# Altium schematic sheet Buck converter.SchDoc
size A; SheetNumber: 1; SheetTotal: 1
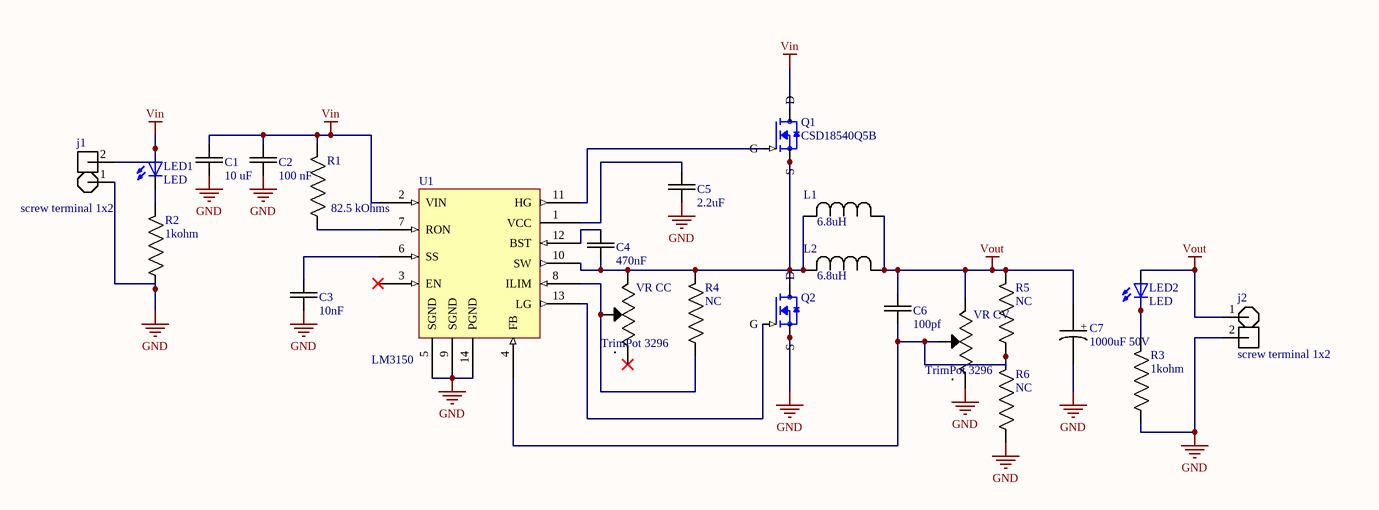
[diagram p0: Buck converter.SchDoc]

## Parts
C1  10 uF  [SMD Cap 805]
C2  100 nF  [SMD Cap 805]
C3  10nF  [SMD Cap 805]
C4  470nF  [SMD Cap 805]
C5  2.2uF  [SMD Cap 805]
C6  100pf  [SMD Cap 805]
C7  1000uF 50V  [CAP ELECTROLYTE 1000UF 50V]
j1  screw terminal 1x2  [screw terminal 1x2]
j2  screw terminal 1x2  [screw terminal 1x2]
L1  6.8uH  [Inductor DR127]
L2  6.8uH  [Inductor DR127]
LED1  LED  [LED3MM]
LED2  LED  [LED3MM]
Q1  CSD18540Q5B  [VSON-CLIP-8 - V2]
Q2  CSD18540Q5B  [VSON-CLIP-8 - V2]  (value not drawn)
R1  82.5 kOhms  [SMD Resistor 805]
R2  1kohm  [SMD Resistor 805]
R3  1kohm  [SMD Resistor 805]
R4  NC  [SMD Resistor 805]
R5  NC  [SMD Resistor 805]
R6  NC  [SMD Resistor 805]
U1  LM3150  [HTSSOP (14)]
VR_CC  TrimPot 3296  [TrimPOT 3296W]
VR_CV  TrimPot 3296  [TrimPOT 3296W]

## Nets
GND: C1.1 C2.1 C3.1 C5.1 C7.N(-) j1.1 j2.2 Q2.1(S) Q2.2(S) Q2.3(S) R2.1 R3.1 R6.1 U1.5(SGND) U1.9(SGND) U1.14(PGND) VR_CV.1(CCW)
Vin: C1.2 C2.2 j1.2 LED1.A Q1.5(D) R1.2 U1.2(VIN)
Vout: C6.2 C7.P(+) j2.1 L1.1 L2.1 LED2.A R5.2 VR_CV.3(CW)
NetC3_2: C3.2 U1.6(SS)
NetC4_1: C4.1 L1.2 L2.2 Q1.1(S) Q1.2(S) Q1.3(S) Q2.5(D) R4.2 U1.10(SW) VR_CC.3(CW)
NetC4_2: C4.2 U1.12(BST)
NetC5_2: C5.2 U1.1(VCC)
NetC6_1: C6.1 R5.1 R6.2 U1.4(FB) VR_CV.2(WIPER)
NetLED1_C: LED1.C R2.2
NetLED2_C: LED2.C R3.2
NetQ1_4: Q1.4(G) U1.11(HG)
NetQ2_4: Q2.4(G) U1.13(LG)
NetR1_1: R1.1 U1.7(RON)
NetR4_1: R4.1 U1.8(ILIM) VR_CC.2(WIPER)

Not connected (* = marked no-connect by the designer): U1 3(EN)*; VR_CC 1(CCW)*

## Notes on the sheet
- (in symbol TrimPot 3296W) .

## Library data of the parts
C1 = Cap SMD: 0805 10 uF 50 V ±20% Tolerance X5R Multilayer Ceramic Capacitor; Manufacturer: Murata; Manufacturer Part Number: GRM21BR6YA106ME43L; Capacitance: 10uF; Voltage Rating: 35V; Supplier 1: Digi-Key; Supplier Part Number 1: 490-10515-1-ND; RoHS: Yes; Category: Ceramic Capacitors; Stock 1: 33589; Pricing 1: 1=0.43000, 10=0.30200, 50=0.21140, 100=0.18110, 500=0.13584, 1000=0.11471 (USD); Mount: Surface Mount; Case/Package: 0805; Case Code (Metric): 2012; Case Code (Imperial): 0805; Weight: 0.000335oz; Min Operating Temperature: -55°C; Max Operating Temperature: 85°C; Packaging: Tape and Reel; Tolerance: 20%; Voltage Rating (DC): 35V; Package Quantity: 3000; Termination: SMD/SMT; Dielectric: X5R; Length: 0.079inch; Width: 0.049inch; Height: 1.25mm; Thickness: 0.057inch; RoHS Compliant: Yes; ComponentLink1URL: http://www.mouser.com/ds/2/281/c02e-2905.pdf?src-supplier=Mouser; ComponentLink1Description: http://www.mouser.com/ds/2/281/c02e-2905.pdf?src-supplier=Mouser; ComponentLink2URL: http://search.murata.co.jp/Ceramy/image/img/A01X/G101/ENG/GRM21BR6YA106ME43-01.pdf?src-supplier=Digi-Key; ComponentLink2Description: http://search.murata.co.jp/Ceramy/image/img/A01X/G101/ENG/GRM21BR6YA106ME43-01.pdf?src-supplier=Digi-Key
C2 = Cap SMD: CAP CERAMIC, 0.1UF, 10%, 50V, X7R, 0805; Product Range:(Not Available); Capacitance:0.1µF; Capacitance Tolerance:± 10%; Dielectric Characteristic:X7R; Voltage Rating:50V; Capacitor Case Style:0805 [2012 Metric]; Packaging:Full Reel ;RoHS Compliant: Yes; Manufacturer: Kyocera AVX; Manufacturer Part Number: 08055C104KAT2A; Capacitance: 100nF; Insulation Resistance: 100GR; Dissipation Factor: 2.5%; Supplier 1: Digi-Key; Supplier Part Number 1: 478-1395-1-ND; RoHS: Yes; Category: Ceramic Capacitors; Stock 1: 6160485; Pricing 1: 1=0.10000, 10=0.07600, 50=0.04140, 100=0.03380, 500=0.02416, 1000=0.01898 (USD); Mount: Surface Mount,PCB; Case/Package: 0805; Number of Pins: 2; Case Code (Metric): 2012; Case Code (Imperial): 0805; Dielectric Material: Ceramic; Weight: 0.001411oz; Min Operating Temperature: -55°C; Max Operating Temperature: 125°C; Tolerance: 10%; Packaging: Cut Tape; Dielectric: X7R; Voltage Rating: 50V; Package Quantity: 4000; Termination: Standard; Voltage Rating (DC): 50V; Voltage: 50V; Series: MLCC X7R; Length: 2mm; Width: 1.2mm; Height: 0.5mm; Depth: 1.25mm; Thickness: 0.037inch; Radiation Hardening: No; REACH SVHC: No SVHC; RoHS Compliant: Yes; Lead Free: Lead Free; ComponentLink1URL: https://datasheet.ciiva.com/19475/2009691-19475858.pdf?src-supplier=Jameco; ComponentLink1Description: https://datasheet.ciiva.com/19475/2009691-19475858.pdf?src-supplier=Jameco; ComponentLink2URL: https://datasheet.ciiva.com/11786/0900766b802d4698-11786116.pdf?src-supplier=RSComponents; ComponentLink2Description: https://datasheet.ciiva.com/11786/0900766b802d4698-11786116.pdf?src-supplier=RSComponents; ComponentLink3URL: https://datasheet.ciiva.com/150/cx7r-150257.pdf?src-supplier=Digi-Key; ComponentLink3Description: https://datasheet.ciiva.com/150/cx7r-150257.pdf?src-supplier=Digi-Key; ComponentLink4URL: https://datasheet.ciiva.com/150/cx7r-150258.pdf?src-supplier=Digi-Key; ComponentLink4Description: https://datasheet.ciiva.com/150/cx7r-150258.pdf?src-supplier=Digi-Key; ComponentLink5URL: https://datasheet.ciiva.com/150/cx7r-150259.pdf?src-supplier=Digi-Key; ComponentLink5Description: https://datasheet.ciiva.com/150/cx7r-150259.pdf?src-supplier=Digi-Key; ComponentLink6URL: https://datasheet.ciiva.com/16199/cx7r-16199014.pdf?src-supplier=Future+Electronics; ComponentLink6Description: https://datasheet.ciiva.com/16199/cx7r-16199014.pdf?src-supplier=Future+Electronics; ComponentLink7URL: https://datasheet.ciiva.com/16536/cx7r-16536873.pdf?src-supplier=Avnet+Asia; ComponentLink7Description: https://datasheet.ciiva.com/16536/cx7r-16536873.pdf?src-supplier=Avnet+Asia; ComponentLink8URL: https://datasheet.ciiva.com/16536/cx7r-16536875.pdf?src-supplier=Avnet+Asia; ComponentLink8Description: https://datasheet.ciiva.com/16536/cx7r-16536875.pdf?src-supplier=Avnet+Asia; ComponentLink9URL: https://datasheet.ciiva.com/11504/cx7r-11504044.pdf?src-supplier=Avnet; ComponentLink9Description: https://datasheet.ciiva.com/11504/cx7r-11504044.pdf?src-supplier=Avnet; ComponentLink10URL: https://datasheet.ciiva.com/2988/cx7r-2988014.pdf?src-supplier=Avnet; ComponentLink10Description: https://datasheet.ciiva.com/2988/cx7r-2988014.pdf?src-supplier=Avnet; ComponentLink11URL: https://datasheet.ciiva.com/5416/cx7r-5416959.pdf?src-supplier=Mouser; ComponentLink11Description: https://datasheet.ciiva.com/5416/cx7r-5416959.pdf?src-supplier=Mouser; ComponentLink12URL: https://datasheet.ciiva.com/7812/cx7r-7812079.pdf?src-supplier=Element14; ComponentLink12Description: https://datasheet.ciiva.com/7812/cx7r-7812079.pdf?src-supplier=Element14
C3 = Cap SMD: Capacitor 10 nF 50 VDC PU=4000 ST, C0805C103K5RACTU, KEMET; Manufacturer Part Number: C0805C103K5RAC-TU; Dielectric Material: Ceramic; Voltage Rating (DC): 50V; Tolerance: 10%; Dielectric: X7R; Supplier 1: Digi-Key; Supplier Part Number 1: 399-1158-1-ND; Manufacturer: KEMET; RoHS: Yes; Category: Ceramic Capacitors; Stock 1: 1963242; Pricing 1: 1=0.120000, 10=0.087000, 50=0.049400, 100=0.040900, 500=0.028660, 1000=0.023720 (USD); Mount: PCB,Surface Mount; Case/Package: 0805; Number of Pins: 2; Case Code (Metric): 2012; Case Code (Imperial): 0805; Min Operating Temperature: -55°C; Max Operating Temperature: 125°C; Capacitance: 10nF; Voltage Rating: 50V; Packaging: Tape and Reel; Package Quantity: 4000; Termination: SMD/SMT; Voltage: 50V; Series: C0805C; Construction: Flat; Length: 2mm; Width: 1.2mm; Height: 0.78mm; Thickness: 0.035inch; Depth: 1.25mm; Lead Pitch: 0.75mm; Radiation Hardening: No; REACH SVHC: No SVHC; ComponentLink1URL: https://datasheet.ciiva.com/7172/1828800-7172412.pdf?src-supplier=Newark; ComponentLink1Description: https://datasheet.ciiva.com/7172/1828800-7172412.pdf?src-supplier=Newark; ComponentLink2URL: https://datasheet.ciiva.com/5904/kem-c1002-x7r-smd-5904709.pdf?src-supplier=Farnell; ComponentLink2Description: https://datasheet.ciiva.com/5904/kem-c1002-x7r-smd-5904709.pdf?src-supplier=Farnell; ComponentLink3URL: https://datasheet.ciiva.com/7842/kem-c1002-x7r-smd-7842533.pdf?src-supplier=Element14; ComponentLink3Description: https://datasheet.ciiva.com/7842/kem-c1002-x7r-smd-7842533.pdf?src-supplier=Element14; ComponentLink4URL: https://datasheet.ciiva.com/28672/1851736-28672830.pdf?src-supplier=Element14; ComponentLink4Description: https://datasheet.ciiva.com/28672/1851736-28672830.pdf?src-supplier=Element14; ComponentLink5URL: https://datasheet.ciiva.com/26923/getdatasheetpartid-759674-26923957.pdf?src-supplier=Verical; ComponentLink5Description: https://datasheet.ciiva.com/26923/getdatasheetpartid-759674-26923957.pdf?src-supplier=Verical; ComponentLink6URL: https://datasheet.ciiva.com/39122/docfinderpartnumberc0402c102k5ractu-39122923.pdf?src-supplier=Onlinecomponents.com; ComponentLink6Description: https://datasheet.ciiva.com/39122/docfinderpartnumberc0402c102k5ractu-39122923.pdf?src-supplier=Onlinecomponents.com
C4 = Cap SMD: TAIYO YUDEN - GMK212BJ474KG-T - SMD Multilayer Ceramic Capacitor, 0.47 µF, 35 V, 0805 [2012 Metric], ± 10%, X5R, M Series; Voltage Rating: 35V; Supplier 1: Digi-Key; Supplier Part Number 1: 587-1289-1-ND; Manufacturer: Taiyo Yuden; Manufacturer Part Number: GMK212BJ474KG-T; RoHS: Yes; Category: Ceramic Capacitors; Stock 1: 29722; Pricing 1: 1=0.19000, 10=0.12900, 50=0.07760, 100=0.06560, 500=0.04484, 1000=0.03968 (USD); Mount: Surface Mount; Case/Package: 0805; Number of Pins: 2; Case Code (Metric): 2012; Case Code (Imperial): 0805; Min Operating Temperature: -55°C; Max Operating Temperature: 85°C; Capacitance: 470nF; Tolerance: 10%; Packaging: Tape and Reel; Package Quantity: 1; Voltage Rating (DC): 35V; Series: M; Dielectric: X5R; Termination: SMD/SMT; Construction: Flat; Length: 0.079inch; Width: 0.049inch; Height: 1.25mm; Thickness: 0.053inch; Depth: 1.25mm; Radiation Hardening: No; RoHS Compliant: Yes; Lead Free: Lead Free; REACH SVHC: No SVHC; ComponentLink1URL: https://datasheet.ciiva.com/7975/1497285-7975673.pdf?src-supplier=Element14; ComponentLink1Description: https://datasheet.ciiva.com/7975/1497285-7975673.pdf?src-supplier=Element14; ComponentLink2URL: https://datasheet.ciiva.com/135/mlcc-all-e-135179.pdf?src-supplier=Digi-Key; ComponentLink2Description: https://datasheet.ciiva.com/135/mlcc-all-e-135179.pdf?src-supplier=Digi-Key; ComponentLink3URL: https://datasheet.ciiva.com/135/mlcc-all-e-135178.pdf?src-supplier=Digi-Key; ComponentLink3Description: https://datasheet.ciiva.com/135/mlcc-all-e-135178.pdf?src-supplier=Digi-Key; ComponentLink4URL: https://datasheet.ciiva.com/135/mlcc-all-e-135180.pdf?src-supplier=Digi-Key; ComponentLink4Description: https://datasheet.ciiva.com/135/mlcc-all-e-135180.pdf?src-supplier=Digi-Key; ComponentLink5URL: https://datasheet.ciiva.com/5442/mlcc01-e-5442106.pdf?src-supplier=Mouser; ComponentLink5Description: https://datasheet.ciiva.com/5442/mlcc01-e-5442106.pdf?src-supplier=Mouser; ComponentLink6URL: https://datasheet.ciiva.com/11596/mlcc-all-e-11596278.pdf?src-supplier=Avnet; ComponentLink6Description: https://datasheet.ciiva.com/11596/mlcc-all-e-11596278.pdf?src-supplier=Avnet; ComponentLink7URL: https://datasheet.ciiva.com/15920/emultilayer-ceramic-capacitor-15920684.pdf?src-supplier=Onlinecomponents.com; ComponentLink7Description: https://datasheet.ciiva.com/15920/emultilayer-ceramic-capacitor-15920684.pdf?src-supplier=Onlinecomponents.com; ComponentLink8URL: https://datasheet.ciiva.com/30070/emultilayer-ceramic-capacitor-30070951.pdf?src-supplier=Onlinecomponents.com; ComponentLink8Description: https://datasheet.ciiva.com/30070/emultilayer-ceramic-capacitor-30070951.pdf?src-supplier=Onlinecomponents.com
C5 = Cap SMD: CAP CER 2.2UF 35V X6S 0805; Manufacturer: TDK; Manufacturer Part Number: C2012X6S1V225K125AB; Dielectric Material: Ceramic; Tolerance: 10%; Supplier 1: Digi-Key; Supplier Part Number 1: 445-14518-1-ND; RoHS: Yes; Category: Ceramic Capacitors; Stock 1: 4330; Pricing 1: 1=0.45000, 10=0.31600, 50=0.23880, 100=0.20790, 500=0.15400, 1000=0.13090 (USD); Mount: Surface Mount; Case/Package: 0805; Case Code (Metric): 2012; Case Code (Imperial): 0805; Weight: 0.000194oz; Min Operating Temperature: -55°C; Max Operating Temperature: 105°C; Packaging: Tape and Reel; Capacitance: 2.2uF; Voltage Rating: 35V; Voltage Rating (DC): 35V; Package Quantity: 2000; Series: C; Termination: SMD/SMT; Dielectric: X6S; Length: 0.079inch; Width: 0.049inch; Height: 1.25mm; Thickness: 0.057inch; RoHS Compliant: Yes; Lead Free: Lead Free; ComponentLink1URL: http://www.mouser.com/ds/2/400/tdk_mlcc_commercial_general_en-542463.pdf?src-supplier=Mouser; ComponentLink1Description: http://www.mouser.com/ds/2/400/tdk_mlcc_commercial_general_en-542463.pdf?src-supplier=Mouser; ComponentLink2URL: https://product.tdk.com/en/products/common/pdf/mlcc_partnumber_description.pdf?src-supplier=Digi-Key; ComponentLink2Description: https://product.tdk.com/en/products/common/pdf/mlcc_partnumber_description.pdf?src-supplier=Digi-Key; ComponentLink3URL: http://product.tdk.com/en/catalog/datasheets/mlcc_commercial_general_en.pdf?src-supplier=Avnet; ComponentLink3Description: http://product.tdk.com/en/catalog/datasheets/mlcc_commercial_general_en.pdf?src-supplier=Avnet
C6 = Cap SMD: KEMET - C0805C101J1GACTU - SMD Multilayer Ceramic Capacitor, 100 pF, 100 V, 0805 [2012 Metric], ± 5%, C0G / NP0; Voltage Rating: 100V; Temperature Coefficient: 30ppm/°C; Dissipation Factor: 0.1%; Supplier 1: Mouser; Supplier Part Number 1: 80-C0805C101J1G; Manufacturer: KEMET; Manufacturer Part Number: C0805C101J1GACTU; RoHS: Yes; Category: Ceramic Capacitors; Stock 1: 7620; Pricing 1: 1=0.12000, 10=0.04700, 50=0.04700, 100=0.03400, 1000=0.02200, 10000=0.01700 (USD); Mount: Surface Mount,PCB; Case/Package: 0805; Number of Pins: 2; Case Code (Imperial): 0805; Case Code (Metric): 2012; Dielectric Material: Ceramic; Contact Plating: Tin,Matte; Contact Material: Tin; Min Operating Temperature: -55°C; Max Operating Temperature: 125°C; Capacitance: 100pF; Tolerance: 5%; Package Quantity: 1; Packaging: Tape and Reel; Dielectric: C0G; Termination: SMD/SMT; Voltage Rating (DC): 100V; Voltage: 100V; Construction: Flat; Series: C; Length: 2mm; Width: 1.2mm; Height: 0.78mm; Thickness: 0.035inch; Depth: 1.25mm; Lead Pitch: 0.75mm; Radiation Hardening: No; REACH SVHC: No SVHC; Lead Free: Lead Free; RoHS Compliant: Yes; ComponentLink1URL: https://datasheet.ciiva.com/144/docfinderpartnumber-c0805c101j1gactu-144890.pdf?src-supplier=Digi-Key; ComponentLink1Description: https://datasheet.ciiva.com/144/docfinderpartnumber-c0805c101j1gactu-144890.pdf?src-supplier=Digi-Key; ComponentLink2URL: https://datasheet.ciiva.com/18193/getdatasheetpartid-93983-18193285.pdf?src-supplier=Verical; ComponentLink2Description: https://datasheet.ciiva.com/18193/getdatasheetpartid-93983-18193285.pdf?src-supplier=Verical; ComponentLink3URL: https://datasheet.ciiva.com/6126/f9080b-0402-series-c0g-6126695.pdf?src-supplier=Farnell; ComponentLink3Description: https://datasheet.ciiva.com/6126/f9080b-0402-series-c0g-6126695.pdf?src-supplier=Farnell; ComponentLink4URL: https://datasheet.ciiva.com/28688/1789732-28688663.pdf?src-supplier=Element14; ComponentLink4Description: https://datasheet.ciiva.com/28688/1789732-28688663.pdf?src-supplier=Element14; ComponentLink5URL: https://datasheet.ciiva.com/7405/1372242-7405224.pdf?src-supplier=Newark; ComponentLink5Description: https://datasheet.ciiva.com/7405/1372242-7405224.pdf?src-supplier=Newark; ComponentLink6URL: https://datasheet.ciiva.com/14591/70095383-14591851.pdf?src-supplier=Allied+Electronics; ComponentLink6Description: https://datasheet.ciiva.com/14591/70095383-14591851.pdf?src-supplier=Allied+Electronics; ComponentLink7URL: https://datasheet.ciiva.com/14589/70095383-14589484.pdf?src-supplier=Allied+Electronics; ComponentLink7Description: https://datasheet.ciiva.com/14589/70095383-14589484.pdf?src-supplier=Allied+Electronics; ComponentLink8URL: https://datasheet.ciiva.com/2988/kem-c1003-c0g-smd-2988557.pdf?src-supplier=Avnet; ComponentLink8Description: https://datasheet.ciiva.com/2988/kem-c1003-c0g-smd-2988557.pdf?src-supplier=Avnet; ComponentLink9URL: https://datasheet.ciiva.com/2988/kem-c1003-c0g-smd-2988558.pdf?src-supplier=Avnet; ComponentLink9Description: https://datasheet.ciiva.com/2988/kem-c1003-c0g-smd-2988558.pdf?src-supplier=Avnet; ComponentLink10URL: https://datasheet.ciiva.com/7842/40889-7842143.pdf?src-supplier=Element14; ComponentLink10Description: https://datasheet.ciiva.com/7842/40889-7842143.pdf?src-supplier=Element14
C7 = Cap electrolyte: CAP ALUM 1000UF 20% 50V RADIAL; Manufacturer: United Chemi-Con; Manufacturer Part Number: EKMG500ETC1R0ME11D; Ripple Current: 13mA; Capacitance: 1uF; Life (Hours): 1000Hour; Lead Diameter: 0.5mm; Dielectric Material: Aluminium; Leakage Current: 1.5mA; Dissipation Factor: 0.12%; Supplier 1: Mouser; RoHS: Yes; Category: Aluminum Electrolytic Capacitors; Stock 1: 5; Pricing 1: 1=0.42000, 10=0.29400, 50=0.29400, 100=0.17600, 500=0.13200, 1000=0.11200, 2000=0.10500, 4000=0.09900, 10000=0.09900 (USD); Mount: Through Hole; Case/Package: Radial; Min Operating Temperature: -55°C; Max Operating Temperature: 105°C; Tolerance: 20%; Package Quantity: 2000; Packaging: Tape and Reel; Voltage Rating: 50V; Voltage Rating (DC): 50V; Termination: Radial; Series: KMG; Construction: RADIAL; Lead Pitch: 5mm; Height - Seated (Max): 0.49inch; Radiation Hardening: No; RoHS Compliant: Yes; ComponentLink1URL: https://datasheet.ciiva.com/15190/getdatasheetpartid-474554-15190838.pdf?src-supplier=Verical; ComponentLink1Description: https://datasheet.ciiva.com/15190/getdatasheetpartid-474554-15190838.pdf?src-supplier=Verical; Supplier Part Number 1: 661-EKMG500C1R0ME11D; Supplier 2: Digi-Key; Supplier Part Number 2: 493-12786-1-ND; Stock 2: 7451; Pricing 2: 1=1.04000, 10=0.79200, 50=0.65820, 100=0.56680 (USD); Number of Pins: 2; Contact Plating: Tin; Voltage: 50V; Diameter: 12.5mm; Length: 25mm; Height: 25mm; REACH SVHC: No SVHC; Lead Free: Lead Free; ComponentLink2URL: https://datasheet.ciiva.com/5333/e-vr-6088-5333431.pdf?src-supplier=Mouser; ComponentLink2Description: https://datasheet.ciiva.com/5333/e-vr-6088-5333431.pdf?src-supplier=Mouser; ComponentLink3URL: https://datasheet.ciiva.com/28592/1909356-28592506.pdf?src-supplier=Element14; ComponentLink3Description: https://datasheet.ciiva.com/28592/1909356-28592506.pdf?src-supplier=Element14; ComponentLink4URL: https://datasheet.ciiva.com/7781/e-vr-7781741.pdf?src-supplier=Element14; ComponentLink4Description: https://datasheet.ciiva.com/7781/e-vr-7781741.pdf?src-supplier=Element14; ComponentLink5URL: https://datasheet.ciiva.com/29547/e-vr-29547646.pdf?src-supplier=Digi-Key; ComponentLink5Description: https://datasheet.ciiva.com/29547/e-vr-29547646.pdf?src-supplier=Digi-Key; ComponentLink6URL: https://datasheet.ciiva.com/16512/e-vr-16512911.pdf?src-supplier=Future+Electronics; ComponentLink6Description: https://datasheet.ciiva.com/16512/e-vr-16512911.pdf?src-supplier=Future+Electronics; ComponentLink7URL: https://datasheet.ciiva.com/29547/e-vr-29547647.pdf?src-supplier=Digi-Key; ComponentLink7Description: https://datasheet.ciiva.com/29547/e-vr-29547647.pdf?src-supplier=Digi-Key; ComponentLink8URL: https://datasheet.ciiva.com/14597/70187464-14597647.pdf?src-supplier=Allied+Electronics; ComponentLink8Description: https://datasheet.ciiva.com/14597/70187464-14597647.pdf?src-supplier=Allied+Electronics
j1 j2 = screw terminal 1x2: WURTH ELEKTRONIK - 691214110002 - Wire-To-Board Terminal Block, 3.5 mm, 2 Positions, 24 AWG, 16 AWG, 1.5 mm², Screw; Manufacturer: Wurth Electronics; Plating: Brass,Steel; Number of Levels: 1; Number of Positions Per Level: 2; Current: 10A; Voltage: 300V; Wire Gauge (Max): 24AWG; Wire Gauge (Min): 16AWG; Pitch: 0.138inch; Stripping Length: -6mm; Supplier 1: Digi-Key; Manufacturer Part Number: 691214110002; RoHS: Yes; Category: Terminal Blocks; Stock 1: 5949; Pricing 1: 1=0.83000, 10=0.73900, 50=0.63800, 100=0.57100, 500=0.53800, 1400=0.50400 (USD); Mount: Through Hole; Color: Blue,Green; Housing Material: PA66; Contact Material: Brass; Contact Plating: Brass,Tin; Min Operating Temperature: -40°C; Max Operating Temperature: 105°C; Packaging: Bulk; Termination: Screw; Package Quantity: 1400; Number of Contacts: 2; Series: WR-TBL Series 2141; Voltage Rating: 300V; Current Rating: 10A; Length: 7.4mm; Width: 7.9mm; Height: 12.2mm; Wire/Cable Gauge: 24AWG; REACH SVHC: Unknown; RoHS Compliant: Yes; ComponentLink1URL: https://datasheet.ciiva.com/824/6912141100xx-824001.pdf?src-supplier=Digi-Key; ComponentLink1Description: https://datasheet.ciiva.com/824/6912141100xx-824001.pdf?src-supplier=Digi-Key; ComponentLink2URL: https://datasheet.ciiva.com/48693/001088618-da-01-en-wr-tbl-terminal-block2141-691214110002-48693195.pdf?src-supplier=Conrad; ComponentLink2Description: https://datasheet.ciiva.com/48693/001088618-da-01-en-wr-tbl-terminal-block2141-691214110002-48693195.pdf?src-supplier=Conrad; Supplier Part Number 1: 732-2747-ND
L1 L2 = Inductor CDRH127: General Purpose Inductor, 6.8uH, 20%, 1 Element, Ferrite-Core, SMD, 4949; Manufacturer: Eaton Cooper; Manufacturer Part Number: DR127-470-R; Current Rating: 2.95A; Shielding: Shielded; Inductance: 47uH; DC Resistance (DCR): 71.9mR; Test Frequency: 100kHz; Max DC Current: 5.28A; Inductor Type: POWER INDUCTOR; Supplier 1: Digi-Key; RoHS: Yes; Category: Fixed Inductors; Stock 1: 11925; Pricing 1: 1=1.62000, 10=1.50600, 25=1.39000, 50=1.15840, 100=1.08880 (USD); Mount: Surface Mount; Case/Package: Nonstandard; Core Material: Ferrite; Min Operating Temperature: -40°C; Max Operating Temperature: 125°C; Tolerance: 20%; Termination: SMD/SMT; Series: DR; Rated Current-Max: 2.95A; Length: 12.5mm; Width: 0.492inch; Height: 8mm; Height - Seated (Max): 0.315inch; Depth: 12.5mm; Radiation Hardening: No; Lead Free: Lead Free; Military Standard: Not; RoHS Compliant: Yes; ComponentLink1URL: https://datasheet.ciiva.com/14667/0900766b8116a153-14667792.pdf?src-supplier=RSComponents; ComponentLink1Description: https://datasheet.ciiva.com/14667/0900766b8116a153-14667792.pdf?src-supplier=RSComponents; Supplier Part Number 1: 513-1050-1-ND; Number of Pins: 2; Weight: 0.208oz; Self Resonant Frequency: 100kHz; Inductance Tolerance: 20%; Resistor Type: Wirewound; RMS Current (Irms): 2.95A; Saturation Current: 5.28A; REACH SVHC: No SVHC; ComponentLink2URL: https://datasheet.ciiva.com/26858/getdatasheetpartid-251127-26858422.pdf?src-supplier=Verical; ComponentLink2Description: https://datasheet.ciiva.com/26858/getdatasheetpartid-251127-26858422.pdf?src-supplier=Verical; ComponentLink3URL: https://datasheet.ciiva.com/16940/70037876-16940727.pdf?src-supplier=Allied+Electronics; ComponentLink3Description: https://datasheet.ciiva.com/16940/70037876-16940727.pdf?src-supplier=Allied+Electronics; ComponentLink4URL: https://datasheet.ciiva.com/8005/87246-8005180.pdf?src-supplier=Element14; ComponentLink4Description: https://datasheet.ciiva.com/8005/87246-8005180.pdf?src-supplier=Element14; ComponentLink5URL: https://datasheet.ciiva.com/30240/43bus-elx-ds-4315-dr-ser-30240985.pdf?src-supplier=Onlinecomponents.com; ComponentLink5Description: https://datasheet.ciiva.com/30240/43bus-elx-ds-4315-dr-ser-30240985.pdf?src-supplier=Onlinecomponents.com; Supplier 2: Digi-Key; Supplier Part Number 2: 513-1530-1-ND; Stock 2: 288; Pricing 2: 1=1.46000, 10=1.35100, 25=1.24720, 50=1.03960, 100=0.97710, 250=0.87320 (USD); Packaging: Tape and Reel; Package Quantity: 600; ComponentLink6URL: https://datasheet.ciiva.com/26858/getdatasheetpartid-249064-26858398.pdf?src-supplier=Verical; ComponentLink6Description: https://datasheet.ciiva.com/26858/getdatasheetpartid-249064-26858398.pdf?src-supplier=Verical; ComponentLink7URL: https://datasheet.ciiva.com/30075/4a32919a-7470-4ae0-be45-b59e3a1351ef-30075147.pdf?src-supplier=Onlinecomponents.com; ComponentLink7Description: https://datasheet.ciiva.com/30075/4a32919a-7470-4ae0-be45-b59e3a1351ef-30075147.pdf?src-supplier=Onlinecomponents.com
LED1 LED2 = LED: LED 3 mm (T1) red, 151031SS04000, Würth Elektronik; Manufacturer: Wurth Electronics; Luminous Intensity: 160mcd; Viewing Angle: 40°; Forward Voltage: 2V; Lens Style: Diffused,Round,Circular; Wavelength: 635nm; Test Current: 20mA; Forward Current: 30mA; Lens Size: 3mm; ComponentLink1URL: https://datasheet.ciiva.com/22657/151031ss06000-22657010.pdf?src-supplier=Element14; ComponentLink1Description: https://datasheet.ciiva.com/22657/151031ss06000-22657010.pdf?src-supplier=Element14; ComponentLink2URL: https://datasheet.ciiva.com/29335/759483-da-01-en-tht-led-3mm-superrot-151031ss06000-29335440.pdf?src-supplier=Conrad; ComponentLink2Description: https://datasheet.ciiva.com/29335/759483-da-01-en-tht-led-3mm-superrot-151031ss06000-29335440.pdf?src-supplier=Conrad; ComponentLink3URL: https://datasheet.ciiva.com/29562/151031ss06000-29562907.pdf?src-supplier=Digi-Key; ComponentLink3Description: https://datasheet.ciiva.com/29562/151031ss06000-29562907.pdf?src-supplier=Digi-Key; Supplier 1: Digi-Key; Supplier Part Number 1: 732-5005-ND; Manufacturer Part Number: 151031SS04000; RoHS: Yes; Category: LEDs; Stock 1: 354; Pricing 1: 1=0.17000, 50=0.16100, 100=0.13800, 500=0.11900 (USD); Mount: Through Hole; Case/Package: Radial; Color: Red; Min Operating Temperature: -40°C; Max Operating Temperature: 85°C; Package Quantity: 1; Packaging: Bulk; Dominant Wavelength: 635nm; Height: 5.55mm; REACH SVHC: Unknown; RoHS Compliant: Yes; ComponentLink4URL: https://datasheet.ciiva.com/22657/151031ss04000-22657008.pdf?src-supplier=Element14; ComponentLink4Description: https://datasheet.ciiva.com/22657/151031ss04000-22657008.pdf?src-supplier=Element14; ComponentLink5URL: https://datasheet.ciiva.com/29335/759482-da-01-en-tht-led-3mm-superrot-151031ss04000-29335443.pdf?src-supplier=Conrad; ComponentLink5Description: https://datasheet.ciiva.com/29335/759482-da-01-en-tht-led-3mm-superrot-151031ss04000-29335443.pdf?src-supplier=Conrad
Q1 Q2 = CSD18540Q5B: N-Channel 60V 100A _Ta_ 3.1W _Ta_, 195W _Tc_ Surface Mount 8-VSON-CLIP _5x6_; MF: Texas Instruments; SnapEDA_Link: https://www.snapeda.com/parts/CSD18540Q5B/Texas%20Instruments/view-part/272196/?ref=snap; Manufacturer Part Number: CSD18540Q5B; Value: *; Digi-Key_Part_Number: 296-41076-1-ND; Digi-Key_Purchase_URL: https://www.digikey.cl/product-detail/en/texas-instruments/CSD18540Q5B/296-41076-1-ND/5181337?utm_source=snapeda&utm_medium=aggregator&utm_campaign=symbol; Package: VSON-8 Texas Instruments
R1 = Resistor SMD: PANASONIC ELECTRONIC COMPONENTS         ERJ6ENF8252V             SMD Chip Resistor, Thick Film, 82.5 kohm, 150 V, 0805 [2012 Metric], 125 mW,  1%, ERJ6E Series; Manufacturer Part Number: ERJ-6ENF8252V; Resistance: 82.5kR; Power Rating: 125mW; Voltage Rating: 150V; Temperature Coefficient: 100ppm/°C; Supplier 1: Digi-Key; Supplier Part Number 1: P82.5KCCT-ND; Manufacturer: Panasonic; RoHS: Yes; Category: Chip SMD Resistors; Stock 1: 11905; Pricing 1: 1=0.10000, 10=0.07900, 100=0.03030, 1000=0.01333, 2500=0.01152 (USD); Mount: Surface Mount; Case/Package: 0805; Case Code (Metric): 2012; Case Code (Imperial): 0805; Contact Plating: Tin; Weight: 0.000194oz; Min Operating Temperature: -55°C; Max Operating Temperature: 155°C; Tolerance: 1%; Packaging: Tape and Reel; Termination: SMD/SMT; Max Power Dissipation: 125mW; Number of Terminations: 2; Package Quantity: 1; Resistor Type: Thick Film; Voltage Rating (DC): 150V; Features: Automotive AEC-Q200; Series: ERJ; Resistance Tolerance: 1%; Construction: Rectangular; Technology: THICK FILM; Length: 2mm; Width: 0.049inch; Height: 0.6mm; Depth: 1.25mm; REACH SVHC: Unknown; Lead Free: Lead Free; RoHS Compliant: Yes; Military Standard: Not; ComponentLink1URL: https://datasheet.ciiva.com/22668/1678782-22668199.pdf?src-supplier=Element14; ComponentLink1Description: https://datasheet.ciiva.com/22668/1678782-22668199.pdf?src-supplier=Element14; ComponentLink2URL: https://datasheet.ciiva.com/22721/1678782-22721339.pdf?src-supplier=Farnell; ComponentLink2Description: https://datasheet.ciiva.com/22721/1678782-22721339.pdf?src-supplier=Farnell; ComponentLink3URL: https://datasheet.ciiva.com/24160/aoa0000ce2-24160139.pdf?src-supplier=Mouser; ComponentLink3Description: https://datasheet.ciiva.com/24160/aoa0000ce2-24160139.pdf?src-supplier=Mouser; ComponentLink4URL: https://datasheet.ciiva.com/16758/70260748-16758493.pdf?src-supplier=Allied+Electronics; ComponentLink4Description: https://datasheet.ciiva.com/16758/70260748-16758493.pdf?src-supplier=Allied+Electronics; ComponentLink5URL: https://datasheet.ciiva.com/30205/aoa0000ce2-30205501.pdf?src-supplier=Onlinecomponents.com; ComponentLink5Description: https://datasheet.ciiva.com/30205/aoa0000ce2-30205501.pdf?src-supplier=Onlinecomponents.com; ComponentLink6URL: https://datasheet.ciiva.com/28548/1694929-28548590.pdf?src-supplier=Element14; ComponentLink6Description: https://datasheet.ciiva.com/28548/1694929-28548590.pdf?src-supplier=Element14
R2 R3 = Resistor SMD: RESISTOR, 0805 1K 1%, FULL REEL; Product Range:YAGEO - RC Series; Resistance:1kohm; Power Rating:125mW; Resistance Tolerance:± 1%; Resistor Case Style:0805 [2012 Metric]; Resistor Element Material:Thick Film; Temperature Coefficient:± 250ppm/°C; Voltage Rating:150V; Packaging:Tape & Reel; MSL:-; SVHC:No SVHC (16-Dec-2013); External Depth:0.55mm; External Length / Height:2mm; External Width:1.25mm; No. of Pins:2; Operating Temperature Max:155°C; Operating Temperature Min:-55°C; Operating Temperature Range:-55°C to +155°C; Reel Quantity:5000; Resistor Mounting:SMD; Series:RC12H; Temperature Coef; Manufacturer: Yageo; Manufacturer Part Number: RC0805FR-071KL; Resistance: 1kR; Power Rating: 125mW; Voltage Rating: 150V; Temperature Coefficient: 100ppm/°C; Supplier 1: Digi-Key; Supplier Part Number 1: 311-1.00KCRCT-ND; RoHS: Yes; Category: Chip SMD Resistors; Stock 1: 4598539; Pricing 1: 1=0.10000, 10=0.04200, 100=0.01690, 1000=0.00759, 2500=0.00659 (USD); Case/Package: 0805; Number of Pins: 2; Case Code (Metric): 2012; Case Code (Imperial): 0805; Size Code: 0805; Min Operating Temperature: -55°C; Max Operating Temperature: 155°C; Tolerance: 1%; Packaging: Tape and Reel; Resistor Type: Thick Film; Voltage Rating (DC): 150V; Number of Terminations: 2; Termination: SMD/SMT; Package Quantity: 1; Max Power Dissipation: 125mW; Series: RC; Resistance Tolerance: 1%; Construction: Rectangular; Features: Moisture Resistant; Length: 0.079inch; Width: 0.049inch; Height: 0.024inch; Depth: 1.25mm; REACH SVHC: Unknown; RoHS Compliant: Yes; Military Standard: Not; Lead Free: Lead Free; ComponentLink1URL: https://datasheet.ciiva.com/2456/pyu-r-int-thick-7-2456976.pdf?src-supplier=Digi-Key; ComponentLink1Description: https://datasheet.ciiva.com/2456/pyu-r-int-thick-7-2456976.pdf?src-supplier=Digi-Key; ComponentLink2URL: https://datasheet.ciiva.com/2456/pyu-r-int-thick-7-2456977.pdf?src-supplier=Digi-Key; ComponentLink2Description: https://datasheet.ciiva.com/2456/pyu-r-int-thick-7-2456977.pdf?src-supplier=Digi-Key; ComponentLink3URL: https://datasheet.ciiva.com/7941/1686128-7941719.pdf?src-supplier=Element14; ComponentLink3Description: https://datasheet.ciiva.com/7941/1686128-7941719.pdf?src-supplier=Element14; ComponentLink4URL: https://datasheet.ciiva.com/16850/rc0805-16850409.pdf?src-supplier=Future+Electronics; ComponentLink4Description: https://datasheet.ciiva.com/16850/rc0805-16850409.pdf?src-supplier=Future+Electronics; ComponentLink5URL: https://datasheet.ciiva.com/46385/444164-46385020.pdf?src-supplier=Element14; ComponentLink5Description: https://datasheet.ciiva.com/46385/444164-46385020.pdf?src-supplier=Element14; ComponentLink6URL: https://datasheet.ciiva.com/2456/pyu-r-int-thick-7-2456975.pdf?src-supplier=Digi-Key; ComponentLink6Description: https://datasheet.ciiva.com/2456/pyu-r-int-thick-7-2456975.pdf?src-supplier=Digi-Key
R4 R5 = Resistor SMD: RESISTOR, 0805 1K 1%, FULL REEL; Product Range:YAGEO - RC Series; Resistance:1kohm; Power Rating:125mW; Resistance Tolerance:± 1%; Resistor Case Style:0805 [2012 Metric]; Resistor Element Material:Thick Film; Temperature Coefficient:± 250ppm/°C; Voltage Rating:150V; Packaging:Tape & Reel; MSL:-; SVHC:No SVHC (16-Dec-2013); External Depth:0.55mm; External Length / Height:2mm; External Width:1.25mm; No. of Pins:2; Operating Temperature Max:155°C; Operating Temperature Min:-55°C; Operating Temperature Range:-55°C to +155°C; Reel Quantity:5000; Resistor Mounting:SMD; Series:RC12H; Temperature Coef; Manufacturer: Yageo; Manufacturer Part Number: RC0805FR-071KL; Power Rating: 125mW; Voltage Rating: 150V; Temperature Coefficient: 100ppm/°C; Supplier 1: Digi-Key; Supplier Part Number 1: 311-1.00KCRCT-ND; RoHS: Yes; Category: Chip SMD Resistors; Stock 1: 4598539; Pricing 1: 1=0.10000, 10=0.04200, 100=0.01690, 1000=0.00759, 2500=0.00659 (USD); Case/Package: 0805; Number of Pins: 2; Case Code (Metric): 2012; Case Code (Imperial): 0805; Size Code: 0805; Min Operating Temperature: -55°C; Max Operating Temperature: 155°C; Resistance: NC; Tolerance: 1%; Packaging: Tape and Reel; Resistor Type: Thick Film; Voltage Rating (DC): 150V; Number of Terminations: 2; Termination: SMD/SMT; Package Quantity: 1; Max Power Dissipation: 125mW; Series: RC; Resistance Tolerance: 1%; Construction: Rectangular; Features: Moisture Resistant; Length: 0.079inch; Width: 0.049inch; Height: 0.024inch; Depth: 1.25mm; REACH SVHC: Unknown; RoHS Compliant: Yes; Military Standard: Not; Lead Free: Lead Free; ComponentLink1URL: https://datasheet.ciiva.com/2456/pyu-r-int-thick-7-2456976.pdf?src-supplier=Digi-Key; ComponentLink1Description: https://datasheet.ciiva.com/2456/pyu-r-int-thick-7-2456976.pdf?src-supplier=Digi-Key; ComponentLink2URL: https://datasheet.ciiva.com/2456/pyu-r-int-thick-7-2456977.pdf?src-supplier=Digi-Key; ComponentLink2Description: https://datasheet.ciiva.com/2456/pyu-r-int-thick-7-2456977.pdf?src-supplier=Digi-Key; ComponentLink3URL: https://datasheet.ciiva.com/7941/1686128-7941719.pdf?src-supplier=Element14; ComponentLink3Description: https://datasheet.ciiva.com/7941/1686128-7941719.pdf?src-supplier=Element14; ComponentLink4URL: https://datasheet.ciiva.com/16850/rc0805-16850409.pdf?src-supplier=Future+Electronics; ComponentLink4Description: https://datasheet.ciiva.com/16850/rc0805-16850409.pdf?src-supplier=Future+Electronics; ComponentLink5URL: https://datasheet.ciiva.com/46385/444164-46385020.pdf?src-supplier=Element14; ComponentLink5Description: https://datasheet.ciiva.com/46385/444164-46385020.pdf?src-supplier=Element14; ComponentLink6URL: https://datasheet.ciiva.com/2456/pyu-r-int-thick-7-2456975.pdf?src-supplier=Digi-Key; ComponentLink6Description: https://datasheet.ciiva.com/2456/pyu-r-int-thick-7-2456975.pdf?src-supplier=Digi-Key
R6 = Resistor SMD: RESISTOR, 0805 1K 1%, FULL REEL; Product Range:YAGEO - RC Series; Resistance:1kohm; Power Rating:125mW; Resistance Tolerance:± 1%; Resistor Case Style:0805 [2012 Metric]; Resistor Element Material:Thick Film; Temperature Coefficient:± 250ppm/°C; Voltage Rating:150V; Packaging:Tape & Reel; MSL:-; SVHC:No SVHC (16-Dec-2013); External Depth:0.55mm; External Length / Height:2mm; External Width:1.25mm; No. of Pins:2; Operating Temperature Max:155°C; Operating Temperature Min:-55°C; Operating Temperature Range:-55°C to +155°C; Reel Quantity:5000; Resistor Mounting:SMD; Series:RC12H; Temperature Coef; ComponentLink1URL: https://datasheet.ciiva.com/2456/pyu-r-int-thick-7-2456976.pdf?src-supplier=Digi-Key; ComponentLink1Description: https://datasheet.ciiva.com/2456/pyu-r-int-thick-7-2456976.pdf?src-supplier=Digi-Key; ComponentLink2URL: https://datasheet.ciiva.com/2456/pyu-r-int-thick-7-2456977.pdf?src-supplier=Digi-Key; ComponentLink2Description: https://datasheet.ciiva.com/2456/pyu-r-int-thick-7-2456977.pdf?src-supplier=Digi-Key; ComponentLink3URL: https://datasheet.ciiva.com/7941/1686128-7941719.pdf?src-supplier=Element14; ComponentLink3Description: https://datasheet.ciiva.com/7941/1686128-7941719.pdf?src-supplier=Element14; ComponentLink4URL: https://datasheet.ciiva.com/16850/rc0805-16850409.pdf?src-supplier=Future+Electronics; ComponentLink4Description: https://datasheet.ciiva.com/16850/rc0805-16850409.pdf?src-supplier=Future+Electronics; ComponentLink5URL: https://datasheet.ciiva.com/46385/444164-46385020.pdf?src-supplier=Element14; ComponentLink5Description: https://datasheet.ciiva.com/46385/444164-46385020.pdf?src-supplier=Element14; ComponentLink6URL: https://datasheet.ciiva.com/2456/pyu-r-int-thick-7-2456975.pdf?src-supplier=Digi-Key; ComponentLink6Description: https://datasheet.ciiva.com/2456/pyu-r-int-thick-7-2456975.pdf?src-supplier=Digi-Key
U1 = LM3150: IC REG CTRLR BUCK 14TSSOP; Manufacturer: TI National Semiconductor; Manufacturer Part Number: LM3150MHX/NOPB; Output Current: 12A; Switching Frequency: 1MHz; Output Voltage: 600mV; Number of Outputs: 1; Min Supply Voltage: 6V; Max Supply Voltage: 42V; Duty Cycle: 95%; Quiescent Current: 3.5mA; Max Duty Cycle: 96%; Supplier 1: Digi-Key; RoHS: Yes; Category: Voltage Regulators - Switching; Pricing 1: 1=3.67000, 10=3.29700, 25=3.11720, 100=2.70160, 250=2.56304, 500=2.29980, 1000=2.28725 (USD); Mount: Surface Mount; Case/Package: HTSSOP; Number of Pins: 14; Contact Plating: Tin,Matte; Min Operating Temperature: -40°C; Max Operating Temperature: 125°C; Package Quantity: 2500; Packaging: Tape and Reel; Series: PowerWise®, SIMPLE SWITCHER®; Max Frequency: 1MHz; Features: UVLO; Radiation Hardening: No; REACH SVHC: No SVHC; Lead Free: Lead Free; RoHS Compliant: Yes; Supplier Part Number 1: 296-35276-1-ND
VR_CC VR_CV = TrimPot 3296W: Trimmer Resistors - Through Hole 3/8 1Kohms Sealed Vertical Adjust; Manufacturer: Bourns; Manufacturer Part Number: 3296W-1-102LF; Resistance: 1kR; Power Rating: 500mW; Tolerance: 10%; Temperature Coefficient: 100ppm/°C; Number of Turns: 25; Insulation Resistance: 1GR; Supplier 1: Digi-Key; RoHS: Yes; Category: Variable Resistors and Potentiometers; Pricing 1: 1=2.41000, 10=2.11700, 25=1.89800, 50=1.82500, 100=1.75200, 250=1.67900, 500=1.38700, 1000=1.31400, 5000=1.09500 (USD); Mount: Through Hole,Panel,PCB; Weight: 0.03oz; Color: Blue; Contact Plating: Tin,Matte; Min Operating Temperature: -55°C; Max Operating Temperature: 125°C; Packaging: Rail/Tube; Resistor Type: Cermet; Termination: Pin; Package Quantity: 50; Taper: Linear; Max Power Dissipation: 500mW; Length: 9.53mm; Width: 9.53mm; Height: 0.395inch; Depth: 4.83mm; Radiation Hardening: No; Military Standard: Not; REACH SVHC: No SVHC; Lead Free: Lead Free; ComponentLink1URL: https://datasheet.ciiva.com/11831/0900766b8069ccf4-11831058.pdf?src-supplier=RSComponents; ComponentLink1Description: https://datasheet.ciiva.com/11831/0900766b8069ccf4-11831058.pdf?src-supplier=RSComponents; ComponentLink2URL: https://datasheet.ciiva.com/26913/3296w-1-102lf-26913883.pdf?src-supplier=IIIC; ComponentLink2Description: https://datasheet.ciiva.com/26913/3296w-1-102lf-26913883.pdf?src-supplier=IIIC; ComponentLink3URL: https://datasheet.ciiva.com/2156/3296-2156898.pdf?src-supplier=Digi-Key; ComponentLink3Description: https://datasheet.ciiva.com/2156/3296-2156898.pdf?src-supplier=Digi-Key; ComponentLink4URL: https://datasheet.ciiva.com/16467/3296-16467957.pdf?src-supplier=Avnet+Asia; ComponentLink4Description: https://datasheet.ciiva.com/16467/3296-16467957.pdf?src-supplier=Avnet+Asia; ComponentLink5URL: https://datasheet.ciiva.com/30155/3296-30155542.pdf?src-supplier=Onlinecomponents.com; ComponentLink5Description: https://datasheet.ciiva.com/30155/3296-30155542.pdf?src-supplier=Onlinecomponents.com; ComponentLink6URL: https://datasheet.ciiva.com/1131/1815117-1131272.pdf?src-supplier=Element14; ComponentLink6Description: https://datasheet.ciiva.com/1131/1815117-1131272.pdf?src-supplier=Element14; ComponentLink7URL: https://datasheet.ciiva.com/3266/3296-3266185.pdf?src-supplier=Avnet; ComponentLink7Description: https://datasheet.ciiva.com/3266/3296-3266185.pdf?src-supplier=Avnet; ComponentLink8URL: https://datasheet.ciiva.com/14173/ew3296-dat-e-14173019.pdf?src-supplier=Distrelec; ComponentLink8Description: https://datasheet.ciiva.com/14173/ew3296-dat-e-14173019.pdf?src-supplier=Distrelec; ComponentLink9URL: https://datasheet.ciiva.com/25907/3296-25907227.pdf?src-supplier=Avnet+Europe; ComponentLink9Description: https://datasheet.ciiva.com/25907/3296-25907227.pdf?src-supplier=Avnet+Europe; ComponentLink10URL: https://datasheet.ciiva.com/18411/70153578-18411564.pdf?src-supplier=Allied+Electronics; ComponentLink10Description: https://datasheet.ciiva.com/18411/70153578-18411564.pdf?src-supplier=Allied+Electronics; ComponentLink11URL: https://datasheet.ciiva.com/20164/68-0300e-20164044.pdf?src-supplier=Rapid+Electronics; ComponentLink11Description: https://datasheet.ciiva.com/20164/68-0300e-20164044.pdf?src-supplier=Rapid+Electronics; Supplier Part Number 1: 3296W-102LF-ND